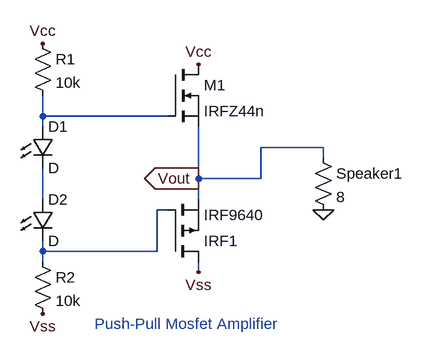
[diagram p0: schematic push_pull_amplifier.asc]
push_pull_amplifier.asc, the LTspice schematic file:
Version 4
SHEET 1 880 680
WIRE 32 64 32 32
WIRE 224 64 32 64
WIRE 32 80 32 64
WIRE 464 112 368 112
WIRE 464 128 464 112
WIRE 272 160 272 80
WIRE 368 160 368 112
WIRE 368 160 272 160
WIRE 32 192 32 144
WIRE 272 192 272 160
WIRE 224 208 208 208
WIRE 32 272 32 256
WIRE 208 272 208 208
WIRE 208 272 32 272
WIRE 32 288 32 272
WIRE 272 304 272 288
FLAG 272 304 Vss
FLAG 272 -16 Vcc
FLAG 32 -48 Vcc
FLAG 32 368 Vss
FLAG 464 208 0
FLAG 272 160 Vout
IOPIN 272 160 Out
SYMBOL res 16 -64 R0
SYMATTR InstName R1
SYMATTR Value 10k
SYMBOL LED 16 80 R0
SYMATTR InstName D1
SYMBOL LED 16 192 R0
SYMATTR InstName D2
SYMBOL res 16 272 R0
SYMATTR InstName R2
SYMATTR Value 10k
SYMBOL res 448 112 R0
SYMATTR InstName Speaker1
SYMATTR Value 8
SYMBOL pmos 224 288 M180
SYMATTR InstName IRF1
SYMATTR Value IRF9640
SYMBOL nmos 224 -16 R0
SYMATTR InstName M1
SYMATTR Value IRFZ44n
TEXT 112 384 Left 2 ;Push-Pull Mosfet Amplifier

The netlist it stands for:
* push_pull_amplifier.asc
R1 Vcc N001 10k
D1 N001 N002 D
D2 N002 N003 D
R2 N003 Vss 10k
R§Speaker1 Vout 0 8
M§IRF1 Vss N003 Vout Vout IRF9640
M1 Vcc N001 Vout Vout IRFZ44n
.model D D
.lib standard.dio
.model NMOS NMOS
.model PMOS PMOS
.lib standard.mos
* Push-Pull Mosfet Amplifier
.backanno
.end